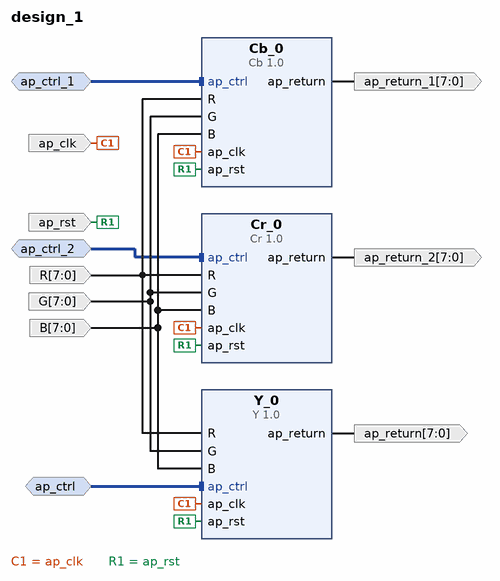
[diagram p0: block diagram of the top level]
# Vivado block design design_1, xc7s100fgga676-2, Vivado 2019.1
create_bd_design design_1

create_bd_intf_port -mode Slave -vlnv xilinx.com:interface:acc_handshake_rtl:1.0 ap_ctrl
create_bd_intf_port -mode Slave -vlnv xilinx.com:interface:acc_handshake_rtl:1.0 ap_ctrl_1
create_bd_intf_port -mode Slave -vlnv xilinx.com:interface:acc_handshake_rtl:1.0 ap_ctrl_2
create_bd_port -dir I -type clk ap_clk
set_property -dict {CONFIG.FREQ_HZ 100000000} [get_bd_ports ap_clk]
create_bd_port -dir I -type rst ap_rst
set_property -dict {CONFIG.POLARITY ACTIVE_HIGH} [get_bd_ports ap_rst]
create_bd_port -dir I -from 7 -to 0 -type data R
create_bd_port -dir I -from 7 -to 0 -type data G
create_bd_port -dir I -from 7 -to 0 -type data B
create_bd_port -dir O -from 7 -to 0 -type data ap_return
create_bd_port -dir O -from 7 -to 0 -type data ap_return_1
create_bd_port -dir O -from 7 -to 0 -type data ap_return_2

create_bd_cell -type ip -vlnv xilinx.com:hls:Y:1.0 Y_0
create_bd_cell -type ip -vlnv xilinx.com:hls:Cb:1.0 Cb_0
create_bd_cell -type ip -vlnv xilinx.com:hls:Cr:1.0 Cr_0

# ---- connections ----

connect_bd_intf_net -intf_net ap_ctrl_1_1 [get_bd_intf_ports ap_ctrl_1] [get_bd_intf_pins Cb_0/ap_ctrl]
connect_bd_intf_net -intf_net ap_ctrl_2_1 [get_bd_intf_ports ap_ctrl_2] [get_bd_intf_pins Cr_0/ap_ctrl]
connect_bd_intf_net [get_bd_intf_ports ap_ctrl] [get_bd_intf_pins Y_0/ap_ctrl]
connect_bd_net [get_bd_ports ap_clk] [get_bd_pins Cb_0/ap_clk] [get_bd_pins Cr_0/ap_clk] [get_bd_pins Y_0/ap_clk]
connect_bd_net [get_bd_ports ap_rst] [get_bd_pins Cb_0/ap_rst] [get_bd_pins Cr_0/ap_rst] [get_bd_pins Y_0/ap_rst]
connect_bd_net [get_bd_ports R] [get_bd_pins Cb_0/R] [get_bd_pins Cr_0/R] [get_bd_pins Y_0/R]
connect_bd_net [get_bd_ports G] [get_bd_pins Cb_0/G] [get_bd_pins Cr_0/G] [get_bd_pins Y_0/G]
connect_bd_net [get_bd_ports B] [get_bd_pins Cb_0/B] [get_bd_pins Cr_0/B] [get_bd_pins Y_0/B]
connect_bd_net [get_bd_pins Y_0/ap_return] [get_bd_ports ap_return]
connect_bd_net [get_bd_pins Cb_0/ap_return] [get_bd_ports ap_return_1]
connect_bd_net [get_bd_pins Cr_0/ap_return] [get_bd_ports ap_return_2]

validate_bd_design
save_bd_design
